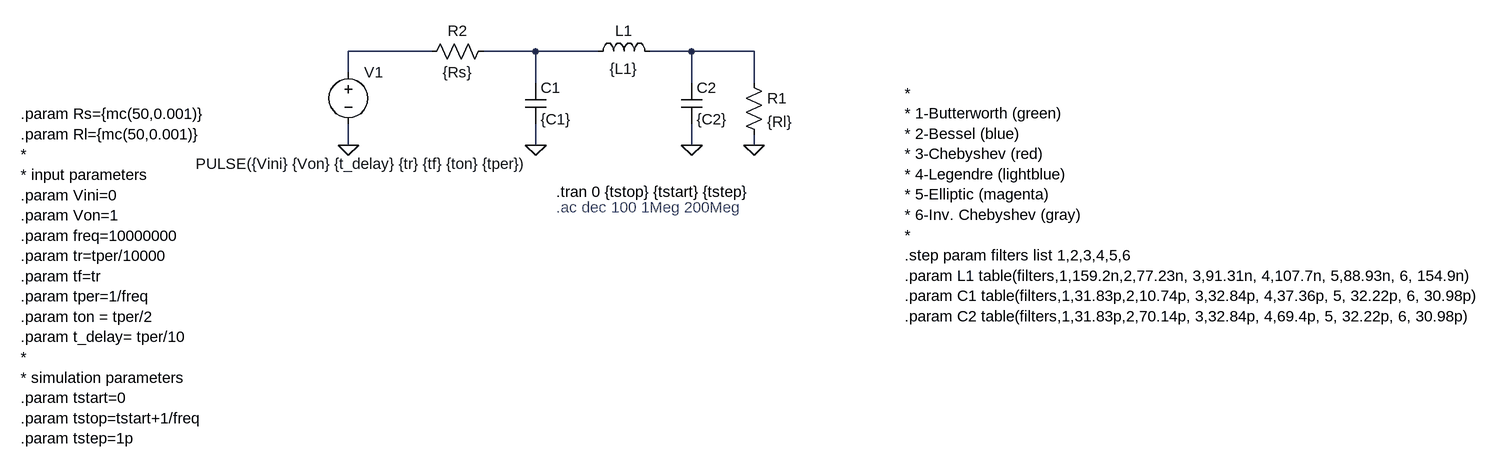
[diagram p0: schematic filters.asc]
filters.asc, the LTspice schematic file:
Version 4
SHEET 1 1708 680
WIRE 0 -160 -128 -160
WIRE 160 -160 80 -160
WIRE 256 -160 160 -160
WIRE 400 -160 336 -160
WIRE 496 -160 400 -160
WIRE -128 -128 -128 -160
WIRE 160 -112 160 -160
WIRE 400 -112 400 -160
WIRE 496 -112 496 -160
WIRE -128 -16 -128 -48
WIRE 160 -16 160 -48
WIRE 400 -16 400 -48
WIRE 496 -16 496 -32
FLAG -128 -16 0
FLAG 160 -16 0
FLAG 400 -16 0
FLAG 496 -16 0
SYMBOL res 480 -128 R0
SYMATTR InstName R1
SYMATTR Value {Rl}
SYMBOL res 96 -176 R90
WINDOW 0 0 56 VBottom 2
WINDOW 3 32 56 VTop 2
SYMATTR InstName R2
SYMATTR Value {Rs}
SYMBOL ind 240 -144 R270
WINDOW 0 32 56 VTop 2
WINDOW 3 5 56 VBottom 2
SYMATTR InstName L1
SYMATTR Value {L1}
SYMBOL cap 144 -112 R0
SYMATTR InstName C1
SYMATTR Value {C1}
SYMBOL cap 384 -112 R0
SYMATTR InstName C2
SYMATTR Value {C2}
SYMBOL voltage -128 -144 R0
WINDOW 3 -235 157 Left 2
SYMATTR Value PULSE({Vini} {Von} {t_delay} {tr} {tf} {ton} {tper})
SYMATTR InstName V1
SYMATTR Value2 AC 1 0
TEXT -632 -64 Left 2 !.param Rs={mc(50,0.001)}\n.param Rl={mc(50,0.001)}\n*\n* input parameters\n.param Vini=0\n.param Von=1\n.param freq=10000000\n.param tr=tper/10000\n.param tf=tr\n.param tper=1/freq\n.param ton = tper/2\n.param t_delay= tper/10\n*\n* simulation parameters\n.param tstart=0\n.param tstop=tstart+1/freq\n.param tstep=1p
TEXT 192 80 Left 2 ;.ac dec 100 1Meg 200Meg
TEXT 192 56 Left 2 !.tran 0 {tstop} {tstart} {tstep}
TEXT 728 -96 Left 2 !*\n* 1-Butterworth (green)\n* 2-Bessel (blue)\n* 3-Chebyshev (red)\n* 4-Legendre (lightblue)    \n* 5-Elliptic (magenta)\n* 6-Inv. Chebyshev (gray)\n*\n.step param filters list 1,2,3,4,5,6\n.param L1 table(filters,1,159.2n,2,77.23n, 3,91.31n, 4,107.7n, 5,88.93n, 6, 154.9n)\n.param C1 table(filters,1,31.83p,2,10.74p, 3,32.84p, 4,37.36p, 5, 32.22p, 6, 30.98p)\n.param C2 table(filters,1,31.83p,2,70.14p, 3,32.84p, 4,69.4p, 5, 32.22p, 6, 30.98p)

The netlist it stands for:
* filters.asc
R1 N003 0 {Rl}
R2 N002 N001 {Rs}
L1 N002 N003 {L1}
C1 N002 0 {C1}
C2 N003 0 {C2}
V1 N001 0 PULSE({Vini} {Von} {t_delay} {tr} {tf} {ton} {tper}) AC 1 0
.param Rs={mc(50,0.001)}
.param Rl={mc(50,0.001)}
*
* input parameters
.param Vini=0
.param Von=1
.param freq=10000000
.param tr=tper/10000
.param tf=tr
.param tper=1/freq
.param ton = tper/2
.param t_delay= tper/10
*
* simulation parameters
.param tstart=0
.param tstop=tstart+1/freq
.param tstep=1p
* .ac dec 100 1Meg 200Meg
.tran 0 {tstop} {tstart} {tstep}
*
* 1-Butterworth (green)
* 2-Bessel (blue)
* 3-Chebyshev (red)
* 4-Legendre (lightblue)
* 5-Elliptic (magenta)
* 6-Inv. Chebyshev (gray)
*
.step param filters list 1,2,3,4,5,6
.param L1 table(filters,1,159.2n,2,77.23n, 3,91.31n, 4,107.7n, 5,88.93n, 6, 154.9n)
.param C1 table(filters,1,31.83p,2,10.74p, 3,32.84p, 4,37.36p, 5, 32.22p, 6, 30.98p)
.param C2 table(filters,1,31.83p,2,70.14p, 3,32.84p, 4,69.4p, 5, 32.22p, 6, 30.98p)
.backanno
.end